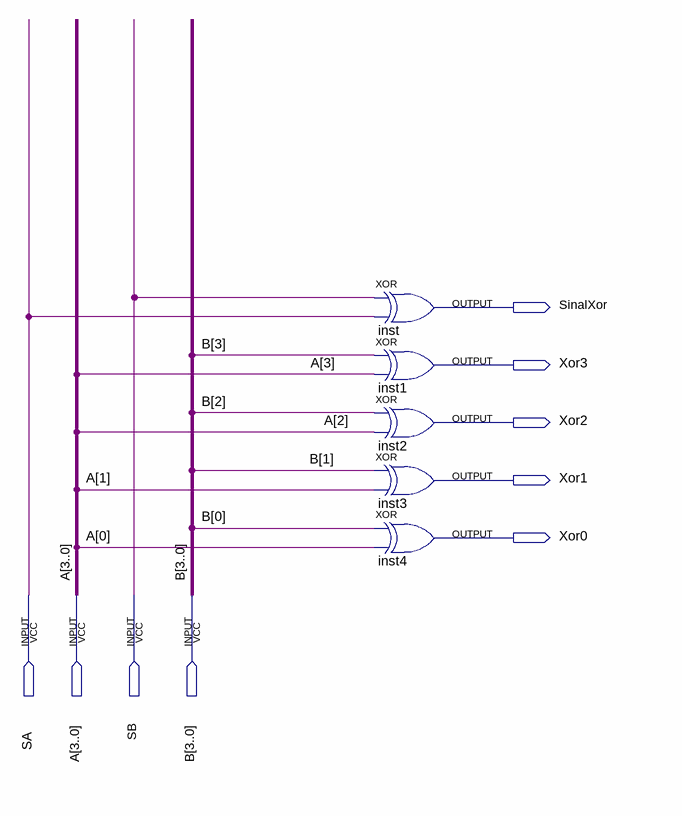
[diagram p0: schematic sheet]
// Quartus schematic CircuitoXor.bdf as structural Verilog: 5 symbols, 9 pins
module CircuitoXor (
  input  SA,
  input  [3:0] A,
  input  SB,
  input  [3:0] B,
  output SinalXor,
  output Xor3,
  output Xor2,
  output Xor1,
  output Xor0
);

  xor inst (SinalXor, SB, SA);
  xor inst1 (Xor3, B[3], A[3]);
  xor inst2 (Xor2, B[2], A[2]);
  xor inst3 (Xor1, B[1], A[1]);
  xor inst4 (Xor0, B[0], A[0]);
endmodule
